# Altium schematic sheet BomNhuDong_ml.SchDoc
size A0
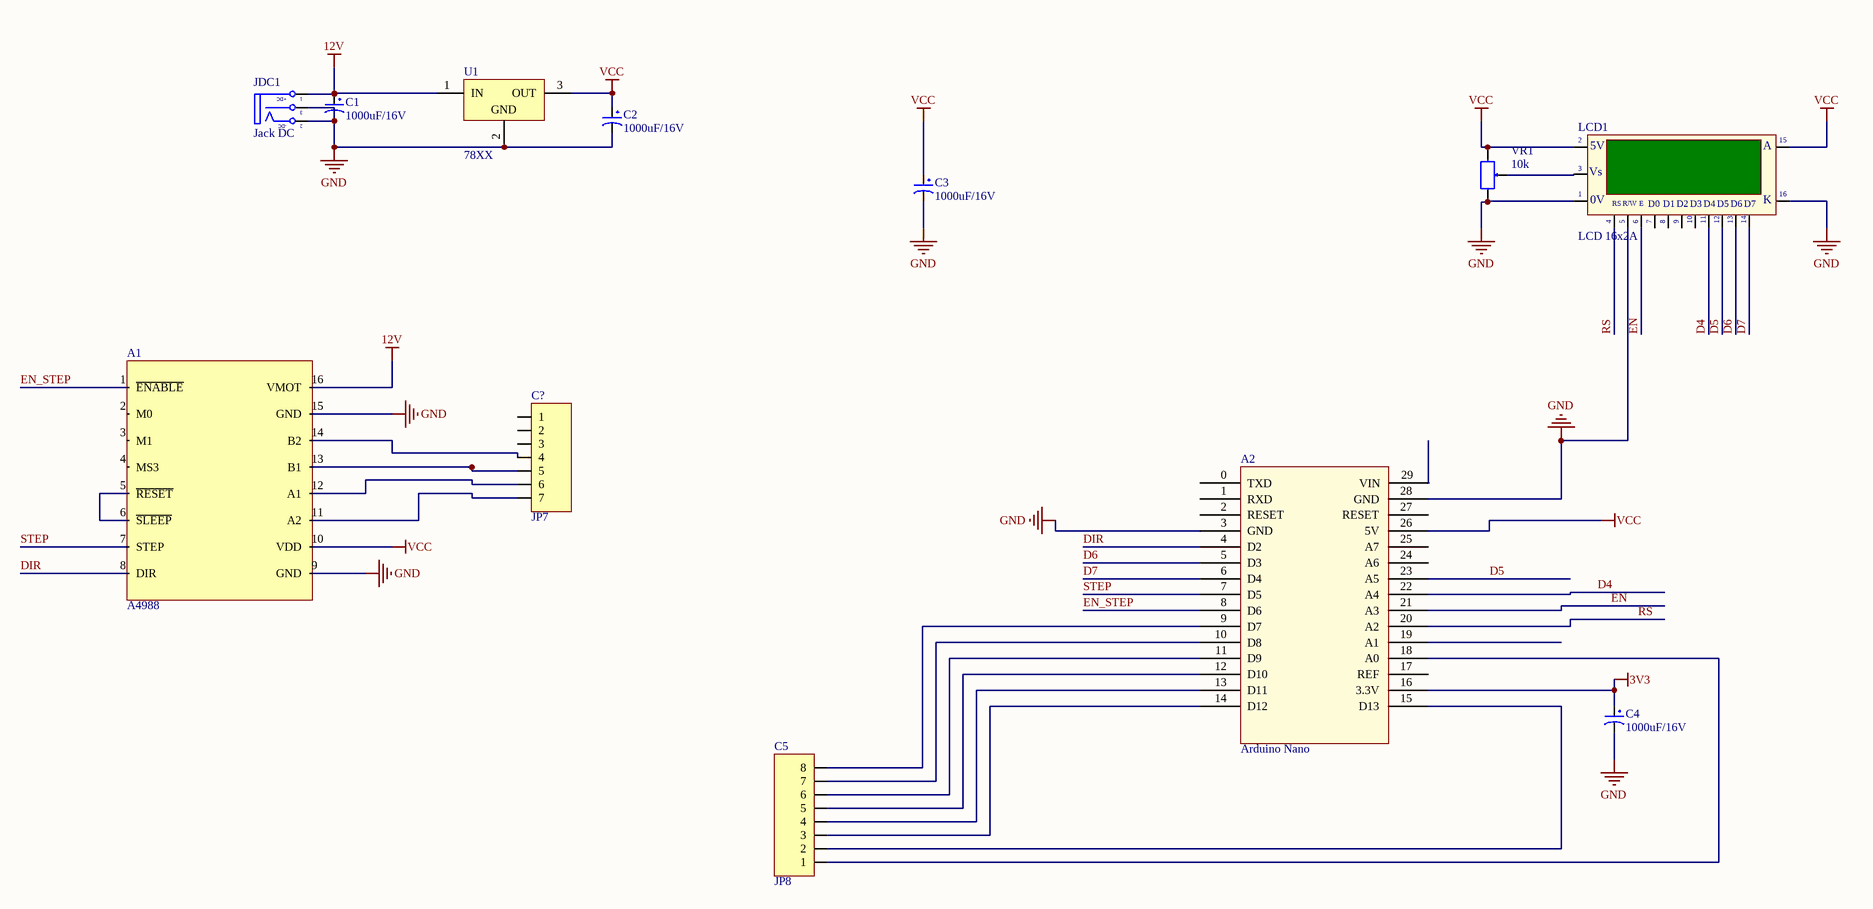
[diagram p0: BomNhuDong_ml.SchDoc]

## Parts
A1  A4988  [A4988]
A2  Arduino Nano  [Arduino Nano]
C1  1000uF/16V  [CP1.5/3.4]
C2  1000uF/16V  [CP1.5/3.4]
C3  1000uF/16V  [CP1.5/3.4]
C4  1000uF/16V  [CP1.5/3.4]
C5  JP8  [JP8-D1T]
C?  JP7  [JP7-D1T]
JDC1  Jack DC  [DC0]
LCD1  LCD 16x2A  [LCD16X2]
U1  78XX  [TO252-123]
VR1  10k  [VR-S2]

## Nets
3V3: A2.16(3.3V) C4.1
12V: A1.16(VMOT) C1.1 JDC1.1(T) U1.1(IN)
GND: A1.9(GND) A1.15(GND) A2.3(GND) A2.28(GND) C1.2 C2.2 C3.2 C4.2 JDC1.2(TN) JDC1.3(S) LCD1.1(GND) LCD1.5(R/~{W}) LCD1.16(K) U1.2(GND) VR1.3
VCC: A1.10(VDD) A2.26(5V) C2.1 C3.1 LCD1.2(VDD) LCD1.15(A) U1.3(OUT) VR1.1
D4: A2.22(A4) LCD1.11(D4)
D5: A2.23(A5) LCD1.12(D5)
D6: A2.5(D3) LCD1.13(D6)
D7: A2.6(D4) LCD1.14(D7)
DIR: A1.8(DIR) A2.4(D2)
EN: A2.21(A3) LCD1.6(~{EN})
EN_STEP: A1.1(~{ENABLE}) A2.8(D6)
RS: A2.20(A2) LCD1.4(RS)
STEP: A1.7(STEP) A2.7(D5)
NetA1_5: A1.5(~{RESET}) A1.6(~{SLEEP})
NetA1_11: A1.11(A2) C?.7
NetA1_12: A1.12(A1) C?.6
NetA1_13: A1.13(B1) C?.5
NetA1_14: A1.14(B2) C?.4
NetA2_9: A2.9(D7) C5.8
NetA2_10: A2.10(D8) C5.7
NetA2_11: A2.11(D9) C5.6
NetA2_12: A2.12(D10) C5.5
NetA2_13: A2.13(D11) C5.4
NetA2_14: A2.14(D12) C5.3
NetA2_15: A2.15(D13) C5.2
NetA2_18: A2.18(A0) C5.1
NetLCD1_3: LCD1.3(VEE) VR1.2

Not connected (* = marked no-connect by the designer): A1 2(M0) 3(M1) 4(MS3); A2 0(TXD) 1(RXD) 2(RESET) 17(REF) 19(A1) 24(A6) 25(A7) 27(RESET) 29(VIN); C? 1 2 3; LCD1 7(D0) 8(D1) 9(D2) 10(D3)

## Notes on the sheet
- (in symbol JACK_DC) +DC; -DC
- (in symbol LCD16x2A) 5V; Vs; |; 0V; R/W; E

## Library data of the parts
C1-C4 = CP4: Cap 1000uF/16V - 220uF/50V; Description 5: 4,7uF>10uF/250V_3,3uF>10uF/400V - 2,2uF>4,7uF/450V; Description 1: 2200uF-3300uF/6,3V - 1000uF-2200uF/10V; Description 2: 1000uF/16V - 470uF => 1000uF/25V - 100uF/100V; Description 3: 330uF>470uF/35V_220uF>470uF/50V_10uF>22uF/250V; Description 4: 220uF => 330uF/63V - 10uF =>33uF/160 - 200V; Value: 1000uF/16V
C5 = JP8: WR-PHD 2.54 mm Angled Socket Header; Manufacturer: W¨¹rth Elektronik eiSos GmbH; partNo: 613008143121; ComponentLink1 Description: Manufacturer; ComponentLink2 Description: Datasheet; NoPins: 08; Created Date: 29 March 2013; ComponentLink1URL: http://www.we-online.com; ComponentLink2URL: http://katalog.we-online.de/em/datasheet/6130xx143121.pdf; Created by: Karrer Zheng
C? = JP7: WR-PHD 2.54 mm Angled Socket Header; Manufacturer: W¨¹rth Elektronik eiSos GmbH; partNo: 613007143121; ComponentLink1 Description: Manufacturer; ComponentLink2 Description: Datasheet; NoPins: 07; Created Date: 29 March 2013; ComponentLink1URL: http://www.we-online.com; ComponentLink2URL: http://katalog.we-online.de/em/datasheet/6130xx143121.pdf; Created by: Karrer Zheng
JDC1 = JACK_DC
LCD1 = LCD16x2A: LCD dipslay 16 char, 2 line; Value: LCD16x2A
U1 = LM78XX
VR1 = Resistor Var